# EAGLE design trace_mockup-2-layer (EAGLE 9.2.2)
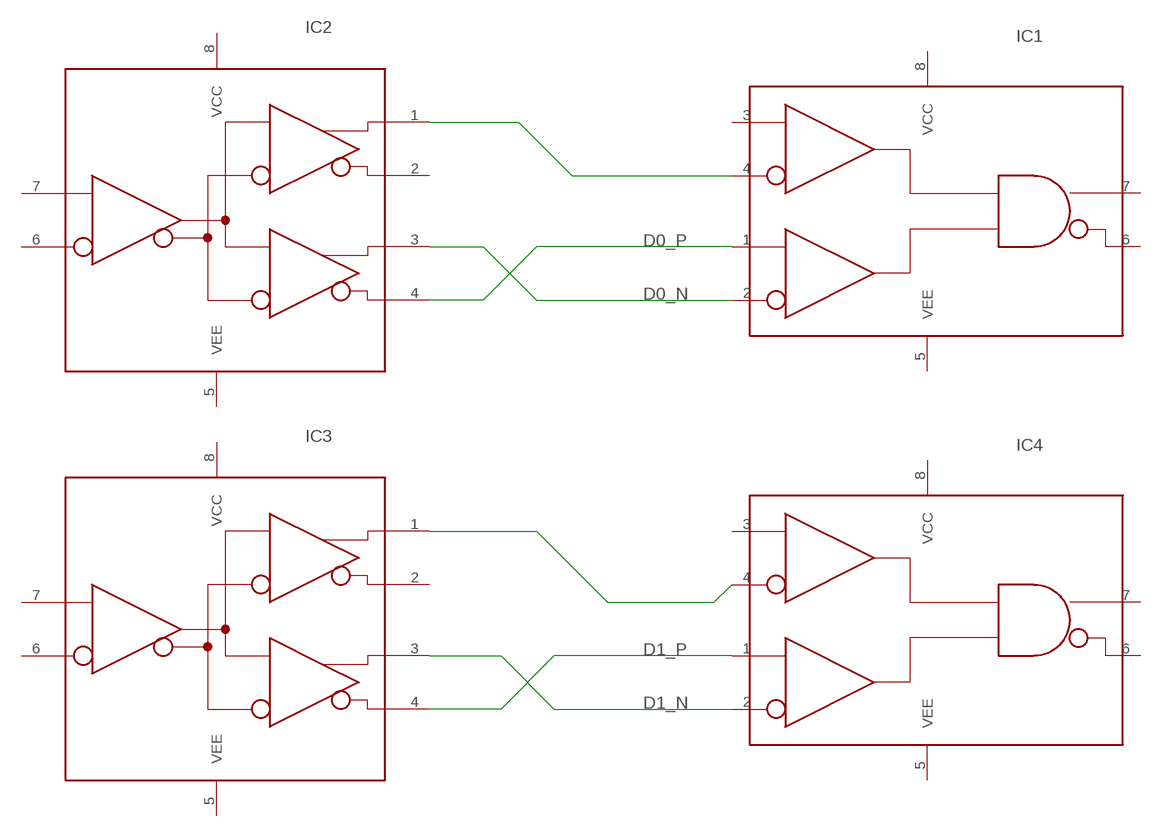
[diagram p0: schematic, sheet 1]

## Parts
IC1  SY10EP05V  [SOIC8]
IC2  SY10EP11U  [SOIC8]
IC3  SY10EP11U  [SOIC8]
IC4  SY10EP05V  [SOIC8]

## Nets
D0_N [100-ohm-pair]: IC1.2(!D0!) IC2.3(Q1)
D0_P [100-ohm-pair]: IC1.1(D0) IC2.4(!Q1!)
D1_N: IC3.3(Q1) IC4.2(!D0!)
D1_P: IC3.4(!Q1!) IC4.1(D0)
N$1 [50-ohm]: IC1.4(!D1!) IC2.1(Q0)
N$2 [4-layer-50]: IC3.1(Q0) IC4.4(!D1!)
Unconnected: IC1.3(D1) IC1.5(VEE) IC1.6(!Q!) IC1.7(Q) IC1.8(VCC) IC2.2(!Q0!) IC2.5(VEE) IC2.6(!D!) IC2.7(D) IC2.8(VCC) IC3.2(!Q0!) IC3.5(VEE) IC3.6(!D!) IC3.7(D) IC3.8(VCC) IC4.3(D1) IC4.5(VEE) IC4.6(!Q!) IC4.7(Q) IC4.8(VCC)

## Library data of the parts
IC1 IC4 = yapo:SY10EP05V
IC2 IC3 = yapo:SY10EP11U

## Net classes
1 100-ohm-pair: width 0.991 mm, clearance 0.254 mm
2 50-ohm: width 2.87 mm
3 4-layer-pair: width 0.229 mm, clearance 0.254 mm
4 4-layer-50: width 0.356 mm

## Board
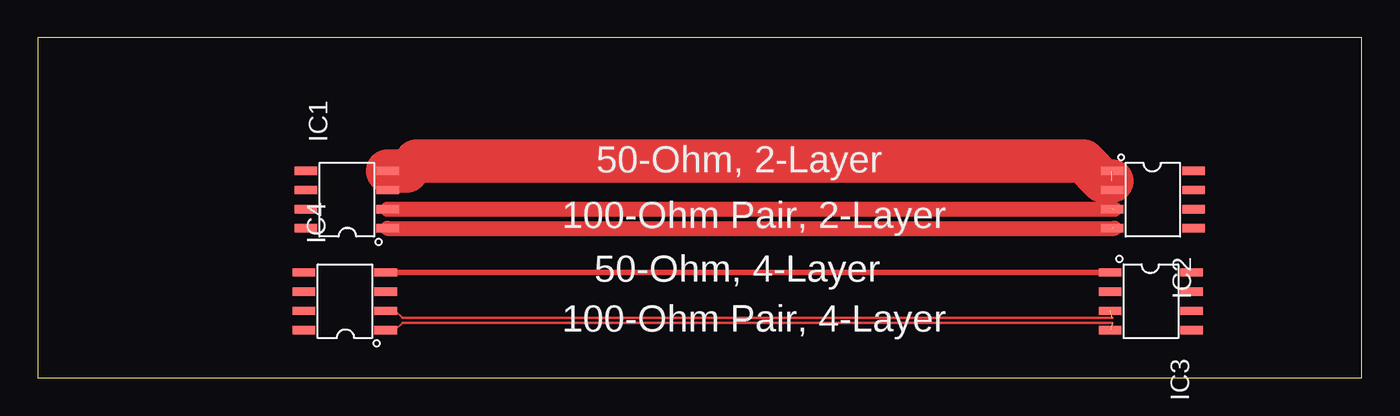
[diagram p1: board, top side]

Size 87.61 x 22.53 mm. Coordinates in mm from the lower left corner, seen from the top.
Outline: 0,0 87.61,0 87.61,22.53 0,22.53 0,0
Copper layers (1*16): Top 0.035559375mm / dielectric 1.6mm / Bottom 0.035559375mm
Design rules "oshpark-2layer": minimum track width 6mil, minimum drill 10mil, track to track 6mil, track to pad 6mil, pad to pad 6mil, via to via 6mil, smd to smd 6mil, copper to edge 15mil, drill to drill 6mil, minimum pad ring 5mil, minimum via ring 5mil, stop-mask expansion 2.5mil, vias tented up to drill 0mil, thermal gap 10mil

### Footprints (pad centres in the part's own frame; a part is rotated, then mirrored left to right if it is on the bottom)
SOIC8 = smd 0.55 x 1.5: 1 -1.905,-2.7; 2 -0.635,-2.7; 3 0.635,-2.7; 4 1.905,-2.7; 5 1.905,2.7; 6 0.635,2.7; 7 -0.635,2.7; 8 -1.905,2.7

### Placement (x,y rotation side)
IC1  20.45,11.81 90 top
IC2  73.79,11.81 270 top
IC3  73.66,5.08 270 top
IC4  20.32,5.08 90 top

### Tracks (layer width: path | path; a pad name or v marks a point on that pad's centre or on a via)
D0_N  (1 unrouted)
  Top 0.991: IC1.2 71.23,11.18 71.25,11.16
D0_P  (1 unrouted)
  Top 0.991: IC1.1 71.23,9.91 71.25,9.92
D1_N  (1 unrouted)
  Top 0.152: IC4.2 23.65,4.45 24.13,3.96 71.12,3.96
D1_P  (1 unrouted)
  Top 0.152: IC4.1 23.65,3.17 24.13,3.66 71.12,3.66
N$1  (1 unrouted)
  Top 2.87: IC1.4 24.42,13.72 25.05,14.35 69.18,14.35 70.5,13.04 71.09,13.04
N$2
  Top 0.356: IC4.4 IC3.1

### Text on the board
tPlace: 50-Ohm, 2-Layer | 100-Ohm Pair, 2-Layer | 50-Ohm, 4-Layer | 100-Ohm Pair, 4-Layer